# EAGLE design Motherboard (EAGLE 9.3.2)
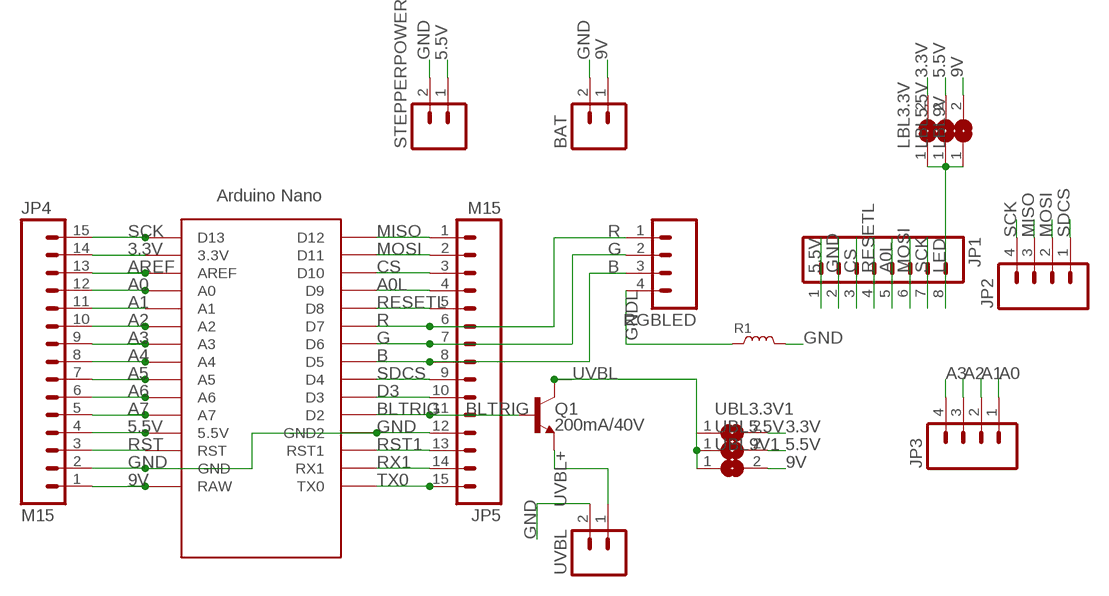
[diagram p0: schematic, sheet 1]

## Parts
BAT  M02PTH  [1X02]
JP1  M08  [1X08]
JP2  M04PTH  [1X04]
JP3  M04PTH  [1X04]
JP4  M15  [1X15]
JP5  M15  [1X15]
LBL3.3V  JUMPER  [SJW]
LBL5.5V  JUMPER  [SJW]
LBL9V  JUMPER  [SJW]
Q1  200mA/40V  TRANS_NPN-2N3904  [TO-92]
R1  COIL-AXL-REGULAR  [AXL-REGULAR]
RGBLED  M04PTH  [1X04]
STEPPERPOWER  M02PTH  [1X02]
U$1  NANO  [NANO]
UBL3.3V1  JUMPER  [SJW]
UBL5.5V  JUMPER  [SJW]
UBL9V1  JUMPER  [SJW]
UVBL  M02LOCK  [1X02_LOCK]

## Nets
3.3V: JP4.14 LBL3.3V.2 U$1.3.3V UBL3.3V1.2
5.5V: JP1.1 JP4.4 LBL5.5V.2 STEPPERPOWER.1 U$1.5V(5.5V) UBL5.5V.2
9V: BAT.1 JP4.1 LBL9V.2 U$1.RAW UBL9V1.2
A0: JP3.1 JP4.12 U$1.A0
A0L: JP1.5 JP5.4 U$1.D9
A1: JP3.2 JP4.11 U$1.A1
A2: JP3.3 JP4.10 U$1.A2
A3: JP3.4 JP4.9 U$1.A3
A4: JP4.8 U$1.A4
A5: JP4.7 U$1.A5
A6: JP4.6 U$1.A6
A7: JP4.5 U$1.A7
AREF: JP4.13 U$1.AREF
B: JP5.8 RGBLED.3 U$1.D5
BLTRIG: JP5.11 Q1.2(B) U$1.D2
CS: JP1.3 JP5.3 U$1.D10
D3: JP5.10 U$1.D3
G: JP5.7 RGBLED.2 U$1.D6
GND: BAT.2 JP1.2 JP4.2 JP5.12 R1.2 STEPPERPOWER.2 U$1.GND U$1.GND1(GND2) UVBL.2
GNDL: R1.1 RGBLED.4
LED: JP1.8 LBL3.3V.1 LBL5.5V.1 LBL9V.1
MISO: JP2.3 JP5.1 U$1.D12
MOSI: JP1.6 JP2.2 JP5.2 U$1.D11
R: JP5.6 RGBLED.1 U$1.D7
RESETL: JP1.4 JP5.5 U$1.D8
RST: JP4.3 U$1.RST
RST1: JP5.13 U$1.RST1
RX1: JP5.14 U$1.RX1
SCK: JP1.7 JP2.4 JP4.15 U$1.D13
SDCS: JP2.1 JP5.9 U$1.D4
TX0: JP5.15 U$1.TX0
UVBL: Q1.3(C) UBL3.3V1.1 UBL5.5V.1 UBL9V1.1
UVBL+: Q1.1(E) UVBL.1
Unconnected: U$1.ICSP1 U$1.ICSP2 U$1.ICSP3 U$1.ICSP4 U$1.ICSP5 U$1.ICSP6

## Library data of the parts
BAT STEPPERPOWER UVBL = SparkFun:M02: Header 2 Standard 2-pin 0.1" header. Use with straight break away headers (SKU : PRT-00116), right angle break away headers (PRT-00553), swiss pins (PRT-00743), machine pins (PRT-00117), and female headers (PRT-00115). Molex polarized connector foot print use with SKU : PRT-08233 with associated crimp pins and housings.
JP1 = SparkFun:M08: Header 8 Standard 8-pin 0.1" header. Use with straight break away headers (SKU : PRT-00116), right angle break away headers (PRT-00553), swiss pins (PRT-00743), machine pins (PRT-00117), and female headers (PRT-00115).
JP2 JP3 RGBLED = SparkFun:M04: Header 4 Standard 4-pin 0.1" header. Use with straight break away headers (SKU : PRT-00116), right angle break away headers (PRT-00553), swiss pins (PRT-00743), machine pins (PRT-00117), and female headers (PRT-00115). Molex polarized connector foot print use with SKU : PRT-08231 with associated crimp pins and housings.
JP4 JP5 = SparkFun:M15: Header 15 Standard 15-pin 0.1" header. Use with straight break away headers (SKU : PRT-00116), right angle break away headers (PRT-00553), swiss pins (PRT-00743), machine pins (PRT-00117), and female headers (PRT-00115).
LBL3.3V LBL5.5V LBL9V UBL3.3V1 UBL5.5V UBL9V1 = BaseApp:JUMPER
Q1 = SparkFun-DiscreteSemi:TRANS_NPN: NPN transistor Current controlled devices typically used to amplify current or used as a switch. BC547 - COM-08928 <http://www.sparkfun.com/products/8928> (TO-92 45V 100mA) (1.Collector 2.Base 3.Emitter) 2N3904 - COM-00521 <http://www.sparkfun.com/products/521> (TO-92 40V 200mA) (1.Emitter 2.Base 3.Collector) P2N2222A - COM-12852 <http://www.sparkfun.com/products/12852> (TO-92 40V 600mA) (1.Collector 2.Base 3.Emitter); PROD_ID: TRANS-08447
R1 = FaBo-Coil:COIL: RESISTOR
U$1 = Arduino-clone:NANO: Arduino Nano

## Board
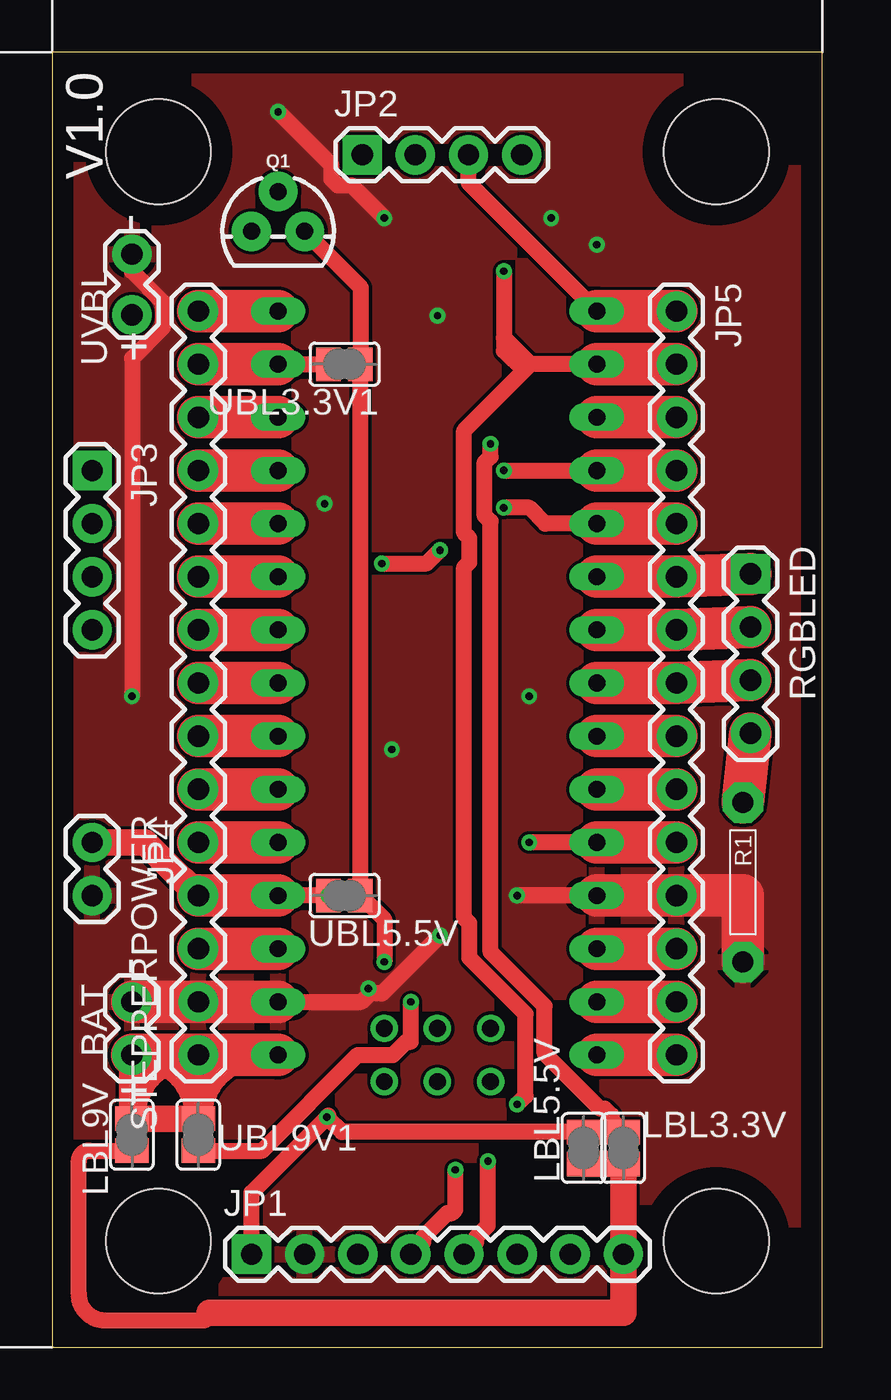
[diagram p1: board, top side]
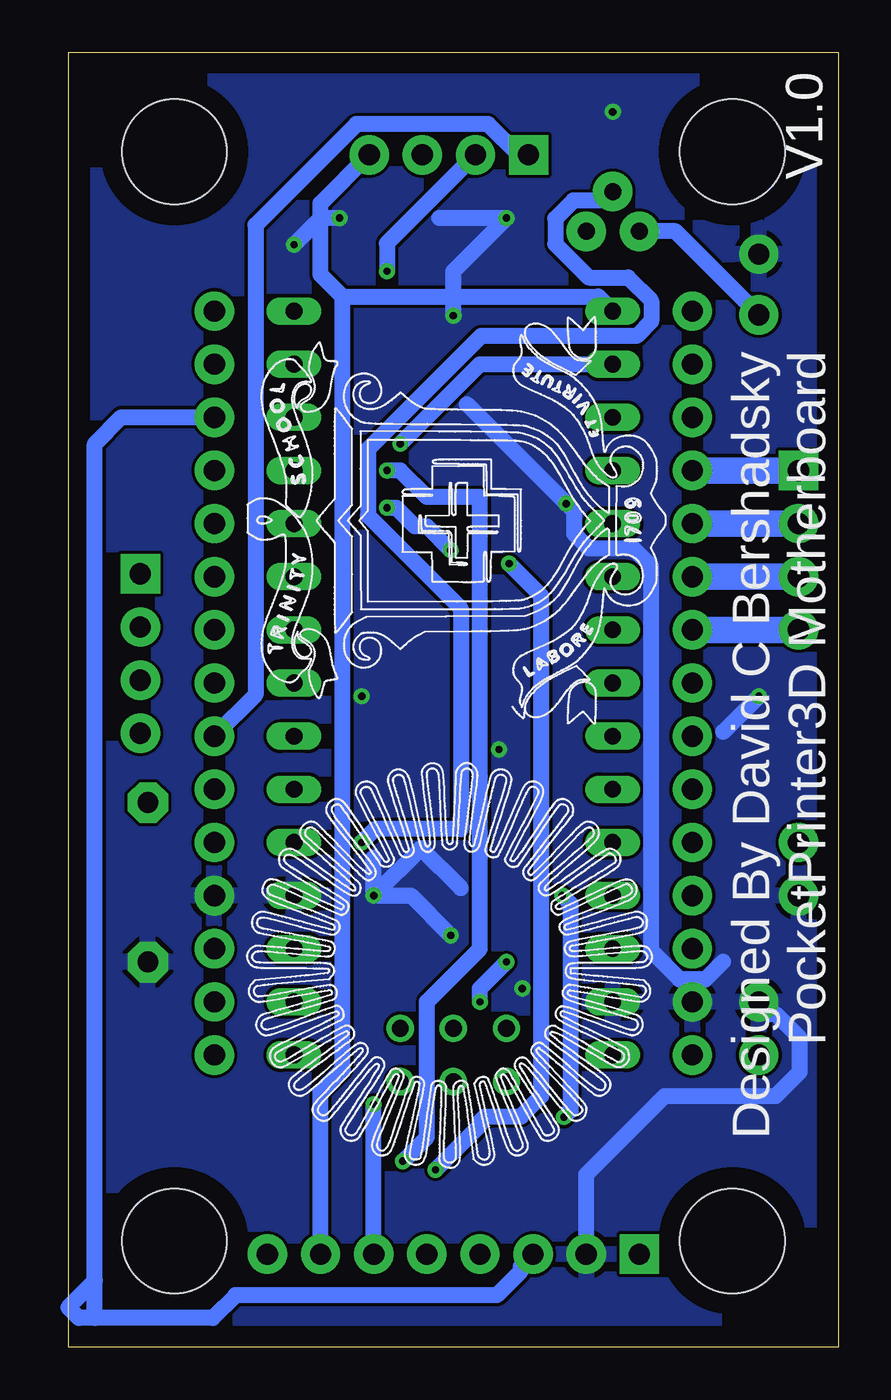
[diagram p2: board, bottom side, seen from below]

Size 36.81 x 61.9 mm. Coordinates in mm from the lower left corner, seen from the top.
Outline: 0,0 36.81,0 36.81,61.9 0,61.9 0,0
Copper layers (1*16): Top 0.035mm / dielectric 1.5mm / Bottom 0.035mm
Design rules "default *": minimum track width 6mil, minimum drill 0.35mm, track to track 6mil, track to pad 6mil, pad to pad 6mil, via to via 6mil, smd to smd 0mil, copper to edge 40mil, drill to drill 6mil, minimum pad ring 10mil, minimum via ring 8mil, stop-mask expansion 4mil, vias tented up to drill 0mil, thermal gap 10mil
Holes 5 mm at 31.75,57.15 5.08,57.15 5.08,5.08 31.75,5.08

### Footprints (pad centres in the part's own frame; a part is rotated, then mirrored left to right if it is on the bottom)
1X02 = drill 1.016 pad 1.88: 1 0,0; 2 2.54,0
1X08 = drill 1.016 pad 1.88 square: 1 0,0 | drill 1.016 pad 1.88: 2 2.54,0; 3 5.08,0; 4 7.62,0; 5 10.16,0; 6 12.7,0; 7 15.24,0; 8 17.78,0
1X04 = drill 1.016 pad 1.88 square: 1 0,0 | drill 1.016 pad 1.88: 2 2.54,0; 3 5.08,0; 4 7.62,0
1X15 = drill 1.016 pad 1.88: 1 0,0; 2 2.54,0; 3 5.08,0; 4 7.62,0; 5 10.16,0; 6 12.7,0; 7 15.24,0; 8 17.78,0; 9 20.32,0; 10 22.86,0; 11 25.4,0; 12 27.94,0; 13 30.48,0; 14 33.02,0; 15 35.56,0
SJW = smd 1.168 x 1.6: 1 -0.762,0; 2 0.762,0
TO-92 = drill 0.813 pad 1.88: 1 -1.27,0; 2 0,1.905; 3 1.27,0
AXL-REGULAR = drill 1 pad 1.93 octagon: 1 -3.81,0; 2 3.81,0
NANO = drill 0.8 long: 3.3V -10.16,24.13; 5V -10.16,-1.27; A0 -10.16,19.05; A1 -10.16,16.51; A2 -10.16,13.97; A3 -10.16,11.43; A4 -10.16,8.89; A5 -10.16,6.35; A6 -10.16,3.81; A7 -10.16,1.27; AREF -10.16,21.59; D2 5.08,1.27; D3 5.08,3.81; D4 5.08,6.35; D5 5.08,8.89; D6 5.08,11.43; D7 5.08,13.97; D8 5.08,16.51; D9 5.08,19.05; D10 5.08,21.59; D11 5.08,24.13; D12 5.08,26.67; D13 -10.16,26.67; GND -10.16,-6.35; GND1 5.08,-1.27; RAW -10.16,-8.89; RST -10.16,-3.81; RST1 5.08,-3.81; RX1 5.08,-6.35; TX0 5.08,-8.89 | drill 0.8: ICSP1 -5.08,-10.16; ICSP2 -5.08,-7.62; ICSP3 -2.54,-10.16; ICSP4 -2.54,-7.62; ICSP5 0,-10.16; ICSP6 0,-7.62
1X02_LOCK = drill 1.016 pad 1.88: 1 -0.178,0; 2 2.718,0

### Placement (x,y rotation side)
BAT  3.81,13.97 90 top
JP1  9.53,4.45 0 top
JP2  14.82,57 0 top
JP3  1.91,41.91 270 top
JP4  6.98,13.97 90 top
JP5  29.84,49.53 270 top
LBL3.3V  27.3,9.52 90 top
LBL5.5V  25.4,9.52 90 top
LBL9V  3.81,10.16 90 top
Q1  10.79,53.34 0 top
R1  33.02,22.23 270 top
RGBLED  33.39,36.96 270 top
STEPPERPOWER  1.91,24.13 270 top
U$1  20.95,22.86 0 top
UBL3.3V1  13.97,46.99 180 top
UBL5.5V  13.97,21.59 180 top
UBL9V1  6.98,10.16 90 top
UVBL  3.81,49.53 90 top

### Tracks (layer width: path | path; a pad name or v marks a point on that pad's centre or on a via)
3.3V  (via drill 0.35)
  Top 0.762: LBL3.3V.2 26.73,10.86 26.73,11.09 26.42,11.4 26.19,11.4 23.54,14.05 23.54,16.31 20.95,18.9 20.95,39.47 20.68,39.75 20.68,42.29 20.95,42.57 v20.95,43.18 | U$1.3.3V UBL3.3V1.2
  Top 2.032: JP4.14 U$1.3.3V
  Bottom 0.762: v20.95,43.18 17.14,46.99 U$1.3.3V
5.5V  (via drill 0.35)
  Top 0.762: LBL5.5V.2 13.84,10.29 v13.13,11 | UBL5.5V.2 U$1.5V | 13.21,11.07 v13.13,11 | JP1.1 9.53,7.39 v13.13,11
  Top 1.27: STEPPERPOWER.1 4.45,24.13 5.18,23.39 5.18,23.38 6.24,22.33 6.25,22.33 JP4.4
  Top 2.032: U$1.5V JP4.4
  Bottom 0.762: UBL5.5V.2 12.81,21.19 12.81,11.32 v13.13,11
  other vias: 13.21,21.59
9V
  Top 1.27: UBL9V1.2 LBL9V.2 | LBL9V.2 BAT.1 3.94,13.97 arc-90 UBL9V1.2 | UBL9V1.2 JP4.1 6.86,13.97 arc90 LBL9V.2 | UBL9V1.2 arc-90 10.03,13.97 U$1.RAW
  Top 2.032: U$1.RAW JP4.1 BAT.1
A0
  Top 2.032: U$1.A0 JP4.12
  Bottom 1.27: JP3.1 JP4.12
A0L  (via drill 0.35)
  Top 0.762: JP1.5 20.27,5.03 20.27,5.25 20.83,5.82 v20.83,8.89 | v21.59,41.91 U$1.D9
  Top 2.032: JP5.4 U$1.D9
  Bottom 0.762: v20.83,8.89 19.68,10.04 19.68,16.51 17.14,19.05 17.14,40.64 19.68,40.64 20.95,41.91 v21.59,41.91
A1
  Top 2.032: JP4.11 U$1.A1
  Bottom 1.27: JP4.11 JP3.2
A2
  Top 2.032: U$1.A2 JP4.10
  Bottom 1.27: JP3.3 JP4.10
A3
  Top 2.032: U$1.A3 JP4.9
  Bottom 1.27: JP4.9 JP3.4
A4
  Top 2.032: JP4.8 U$1.A4
A5
  Top 2.032: U$1.A5 JP4.7
A6
  Top 2.032: U$1.A6 JP4.6
A7
  Top 2.032: JP4.5 U$1.A7
AREF
  Top 2.032: JP4.13 U$1.AREF
B
  Top 2.032: U$1.D5 JP5.8 RGBLED.3
BLTRIG  (via drill 0.35)
  Top 0.762: U$1.D2 v22.8,24.13
  Top 2.032: U$1.D2 JP5.11
  Bottom 0.152: v22.8,24.13 22.76,24.13 22.78,24.15
  Bottom 0.762: Q1.2 11.23,54.81 12.67,54.81 13.54,53.95 13.54,52.73 11.95,51.14 10.07,51.14 8.95,50.02 8.95,49.04 9.65,48.34 17.09,48.34 22.5,42.92 22.5,39.75 18.06,35.3 18.06,24.76 22.16,24.76 22.78,24.15 v22.8,24.13
CS
  Top 2.032: U$1.D10 JP5.3
  Bottom 0.762: JP1.3 15.19,3.86 15.19,3.63 16.34,2.49 28.83,2.49 29.92,1.4 35.56,1.4 | 35.56,1.4 36.32,1.4 36.83,1.9 35.56,3.17 | 35.56,1.4 35.56,3.17 | JP5.3 34.29,44.45 35.56,43.18 35.56,3.17
D3
  Top 2.032: JP5.10 U$1.D3
G
  Top 2.032: RGBLED.2 JP5.7 U$1.D6
GND  (via drill 0.35)
  Top 0.762: U$1.GND1 v22.22,21.59 | v18.54,19.68 15.76,16.91 15.18,16.91 14.78,16.51 U$1.GND | UVBL.2 3.81,51.44 5.28,49.96 5.28,48.74 3.81,47.27 v3.81,31.12 | v15.88,53.98 14.32,55.53 13.66,55.53 13.35,55.84 13.35,56.5 v10.79,59.05
  Top 2.032: U$1.GND1 JP5.12 33.02,21.59 R1.2 | BAT.2 JP4.2 | JP4.2 7.62,16.51 | U$1.GND JP4.2
  Bottom 0.152: v18.54,19.69 18.49,19.71 v18.54,19.68
  Bottom 0.762: JP1.2 12.06,8.26 8.31,12.01 3,12.01 1.85,13.16 1.85,14.78 3,15.93 3.23,15.93 BAT.2 | v22.22,21.59 20.44,21.59 v18.54,19.69 v18.54,19.68 | 5.51,18.44 6.38,17.58 7.6,17.58 8.95,18.93 8.95,37.32 9.81,38.18 11.94,38.18 12.64,38.88 12.64,39.94 v13.02,40.32 17.77,45.07 | v3.81,31.12 5.51,29.41 | v18.41,49.31 18.41,51.43 v15.88,53.98 19.09,53.98 | v22.22,21.59 19.96,23.85 18.06,21.95 | v22.22,21.59 22.22,23.41 | v23.85,53.98 24.77,53.98 v26.04,52.7
  other vias: 16.23,28.57 15.12,17.15 22.8,31.12
  pour Top: 0.64,61.59 36.2,61.59 36.2,0.63 0.64,0.63
  pour Bottom: 0.64,61.59 36.2,61.59 36.2,0.63 0.64,0.63
GNDL
  Top 2.032: RGBLED.4 R1.1
LED
  Top 0.762: 7.52,1.65 arc-90 7.14,1.27 2.54,1.27 arc-90 1.27,2.54 1.27,8.89 arc-90 1.78,9.4 LBL9V.1
  Top 1.27: LBL5.5V.1 LBL3.3V.1 JP1.8 27.3,1.65 7.52,1.65
MISO
  Top 0.762: U$1.D12 19.9,55.66 JP2.3
  Top 2.032: U$1.D12 JP5.1
MOSI  (via drill 0.35)
  Top 0.762: U$1.D11 22.86,46.99 | 22.54,46.67 19.68,43.81 19.68,38.93 19.94,38.68 19.94,37.52 19.68,37.27 19.68,20.51 19.94,20.26 19.94,18.62 22.62,15.93 22.62,12.01 v22.22,11.61 | 22.54,46.67 22.86,46.99 | v21.59,51.43 21.59,48.26 | 21.59,48.26 21.59,47.62 22.54,46.67 | 22.86,46.99 21.59,48.26
  Top 2.032: JP5.2 U$1.D11
  Bottom 0.762: JP1.6 v22.22,11.61 | JP2.2 21.59,52.77 v21.59,51.43
R
  Top 2.032: U$1.D7 JP5.6 RGBLED.1
RESETL  (via drill 0.35)
  Top 0.152: v21.59,40.13 21.54,40.13 v21.59,40.13
  Top 0.762: v19.27,8.48 19.27,6.57 19.1,6.4 18.88,6.4 17.73,5.25 17.73,5.03 JP1.4 | U$1.D8 23.57,39.37 22.8,40.13 v21.59,40.13 | v15.75,37.46 17.9,37.46 v18.54,38.1
  Top 2.032: JP5.5 U$1.D8
  Bottom 0.152: v15.75,37.46 15.75,37.54 v15.75,37.46 | v18.54,38.1 18.49,38.15 v18.54,38.1
  Bottom 0.762: v19.27,8.48 17.14,10.6 17.14,10.79 16.91,11.03 15.18,11.03 14.21,12.01 14.21,35.92 v15.75,37.46 | v21.59,40.13 21.15,40.13 20.26,39.24 19.68,39.24 v18.54,38.1
RST
  Top 2.032: JP4.3 U$1.RST
RST1
  Top 2.032: JP5.13 U$1.RST1
RX1
  Top 2.032: U$1.RX1 JP5.14
SCK
  Top 2.032: U$1.D13 JP4.15
  Bottom 0.762: JP2.4 24.77,54.68 24.77,51.28 23.71,50.22 | JP1.7 24.77,12.22 23.71,13.28 23.71,50.22 | 23.71,50.22 11.49,50.22 U$1.D13
SDCS
  Top 2.032: U$1.D4 JP5.9
  Bottom 0.762: JP5.9 27.88,31.18 27.88,53.65 23.05,58.47 16.75,58.47 15.28,57 JP2.1
TX0
  Top 2.032: JP5.15 U$1.TX0
UVBL  (via drill 0.35)
  Top 0.152: UBL3.3V1.1 14.83,46.99 14.73,46.96
  Top 0.762: v15.88,18.41 15.88,20.45 UBL5.5V.1 14.73,46.96 14.76,46.99 14.76,50.65 Q1.3 | UBL9V1.1 10.03,9.4 14.61,13.97 16.28,13.97 16.92,14.6 17.14,14.6 v17.14,16.51
  Bottom 0.762: v17.14,16.51 17.14,17.15 v15.88,18.41
UVBL+
  Bottom 0.762: UVBL.1 7.8,53.34 Q1.1

### Text on the board
tNames: V1.0 | - | + | - | +
bNames: V1.0 | Designed By David C Bershadsky / PocketPrinter3D Motherboard